# Altium schematic sheet [3]4G.SchDoc
size A4
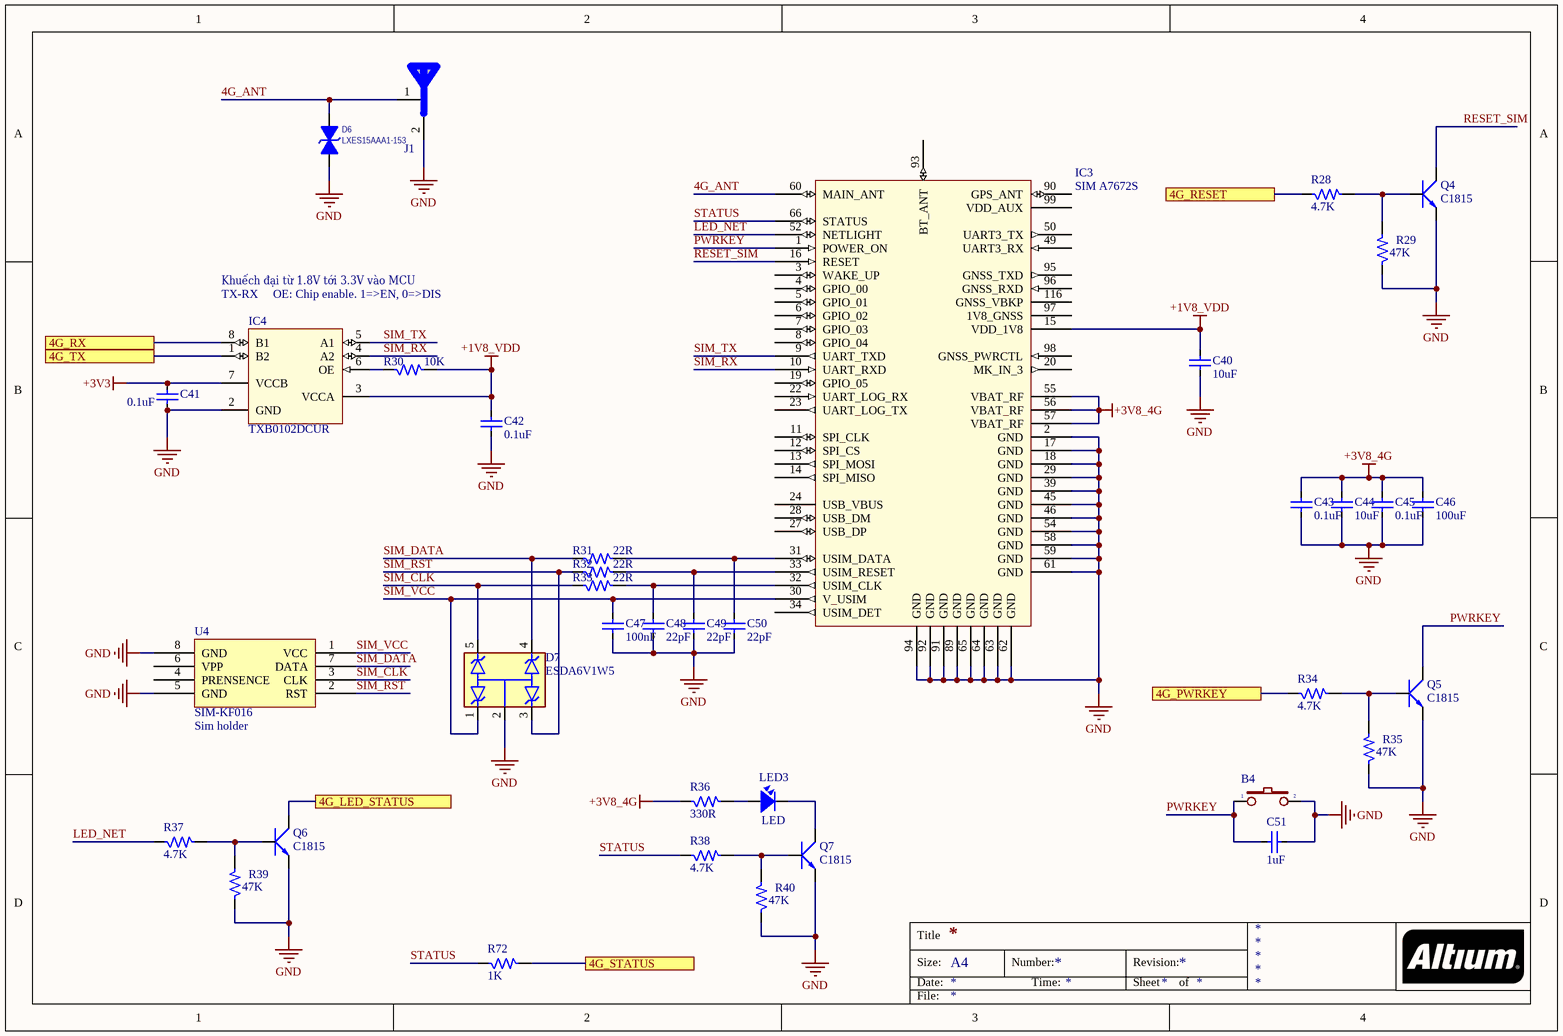
[diagram p0: [3]4G.SchDoc]

## Parts
B4  Button 3x4x2.5  [Button 3x4x2.5]  (value not drawn)
C40  10uF  [CAP_0805]
C41  0.1uF  [CAP_0805]
C42  0.1uF  [CAP_0805]
C43  0.1uF  [CAP_0805]
C44  10uF  [CAP_0805]
C45  0.1uF  [CAP_0805]
C46  100uF  [CAP_0805]
C47  100nF  [CAP_0805]
C48  22pF  [CAP_0805]
C49  22pF  [CAP_0805]
C50  22pF  [CAP_0805]
C51  1uF  [CAP_0805]
D6  LXES15AAA1-153  [R-0402]
D7  ESDA6V1W5  [SOT65P210X110-5N]
IC3  SIM A7672S  [SIM A7672S]
IC4  TXB0102DCUR  [US8]
J1  GPS  [Antenna-MCX5.08-H5]  (value not drawn)
LED3  LED  [LED-0805-Red]
Q4  C1815  [SOT23B]
Q5  C1815  [SOT23B]
Q6  C1815  [SOT23B]
Q7  C1815  [SOT23B]
R28  4.7K  [R0805]
R29  47K  [R0805]
R30  10K  [R0805]
R31  22R  [R0805]
R32  22R  [R0805]
R33  22R  [R0805]
R34  4.7K  [R0805]
R35  47K  [R0805]
R36  330R  [R0805]
R37  4.7K  [R0805]
R38  4.7K  [R0805]
R39  47K  [R0805]
R40  47K  [R0805]
R72  1K  [R0805]
U4  SIM-KF016  value Sim holder  [Sim Socket]

## Ports
4G_LED_STATUS, 4G_PWRKEY, 4G_RESET, 4G_RX, 4G_STATUS, 4G_TX

## Nets
+1V8_VDD: C40.2 C42.2 IC3.15(RESERVED) IC4.3(VCCA) R30.2
+3V3: C41.2 IC4.7(VCCB)
+3V8_4G: C43.2 C44.2 C45.2 C46.2 IC3.55(VBAT_RF) IC3.56(VBAT_RF) IC3.57(VBAT_RF) R36.1
GND: B4.2 C40.1 C41.1 C42.1 C43.1 C44.1 C45.1 C46.1 C47.1 C48.1 C49.1 C50.1 C51.1 D6.2(K) D7.2 IC3.2(GND) IC3.17(GND) IC3.18(GND) IC3.29(KEYPAD_0) IC3.39(GND) IC3.45(GND) IC3.46(ADC2) IC3.54(GPIO4) IC3.58(GND) IC3.59(GND) IC3.61(GND) IC3.62(GND) IC3.63(GND) IC3.64(GND) IC3.65(GND) IC3.89(GND) IC3.91(GND) IC3.92(GND) IC3.94(GND) IC4.2(GND) J1.2(GND) Q4.1(E) Q5.1(E) Q6.1(E) Q7.1(E) R29.1 R35.1 R39.1 R40.1 U4.5(GND) U4.8(GND)
4G_ANT: D6.1(A) IC3.60(MAIN_ANT) J1.1(GND)
4G_LED_STATUS: Q6.2(C) ; port 4G_LED_STATUS
4G_PWRKEY: R34.1 ; port 4G_PWRKEY
4G_RESET: R28.1 ; port 4G_RESET
4G_RX: IC4.8(B1) ; port 4G_RX
4G_STATUS: R72.2 ; port 4G_STATUS
4G_TX: IC4.1(B2) ; port 4G_TX
LED_NET: IC3.52(GPIO41) R37.1
PWRKEY: B4.1 C51.2 IC3.1(POWER_ON) Q5.2(C)
RESET_SIM: IC3.16(RESERVED) Q4.2(C)
SIM_CLK: D7.5 R33.1 U4.3(CLK)
SIM_DATA: D7.4 R31.1 U4.7(DATA)
SIM_RST: D7.3 R32.1 U4.2(RST)
SIM_RX: IC3.10(UART_RXD) IC4.4(A2)
SIM_TX: IC3.9(UART_TXD) IC4.5(A1)
SIM_VCC: C47.2 D7.1 IC3.30(KEYPAD_2) U4.1(VCC)
STATUS: IC3.66(STATUS) R38.1 R72.1
NetC48_2: C48.2 IC3.32(KEYSENSE_N3) R33.2
NetC49_2: C49.2 IC3.33(KEYPAD_1) R32.2
NetC50_2: C50.2 IC3.31(KEYSENSE_N2) R31.2
NetIC4_6: IC4.6(OE) R30.1
NetLED3_1: LED3.1 R36.2
NetLED3_2: LED3.2 Q7.2(C)
NetQ4_3: Q4.3(B) R28.2 R29.2
NetQ5_3: Q5.3(B) R34.2 R35.2
NetQ6_3: Q6.3(B) R37.2 R39.2
NetQ7_3: Q7.3(B) R38.2 R40.2

Not connected (* = marked no-connect by the designer): IC3 3(WAKE_UP) 4(GPIO_00) 5(GPIO_01) 6(GPIO_02) 7(GPIO_03) 8(GPIO_04) 11(SPI_CLK) 12(SPI_CS) 13(SPI_MOSI) 14(SPI_MISO) 19(GPIO_05) 20(MK_IN_3) 21(SPK_M) 22(SPK_P) 23(MIC1P) 24(MIC1N) 25(EAR1N) 26(EAR1P) 27(KEYSENSE_N1) 28(KEYSENSE_N0) 34(KEYPAD_4) 35(KEYPAD_3) 36(KEYSENSE_N4) 47(ADC1) 48(GPIO44) 49(GPIO40) 50(GPIO43) 51(GPIO1) 53(GPIO42) 73(PCM_DOUT) 74(PCM_DIN) 75(PCM_SYNC) 76(PCM_CLK) 90(GPS_ANT) 93(BT_ANT) 95(GNSS_TXD) 96(GNSS_RXD) 97(1V8_GNSS) 98(GNSS_PWRCTL) 99(VDD_AUX) 116(GNSS_VBKP); U4 4(PRENSENCE) 6(VPP)

## Notes on the sheet
- Khuếch đại từ 1.8V tới 3.3V vào MCU
- (near IC4) TX-RX     OE: Chip enable. 1=>EN, 0=>DIS
- Title
- Size:
- Date:
- A4
- Number:
- Time:
- Revision:
- Sheet
- of
- File:

## Library data of the parts
B4 = Button 3x4x2.5: pin to pad: 1>15 2>19
C40-C51 = CapSMD: Capacitor; Value: 33p; Published: 8-Jun-2000; LatestRevisionDate: 17-Jul-2002; LatestRevisionNote: Re-released for DXP Platform.; PackageReference: RAD-0.3; Publisher: Altium Limited
D6 = TVS: TVS DIODE 4VWM 1005; Manufacturer: Murata Electronics; Value: 4V; Category: Circuit Protection; Package: 0402; Part number: LXES15AAA1-153; User_Description: TVS DIODE 4VWM 1005
D7 = ESDA6V1W5: - Clamp - Ipp Tvs Diode Surface Mount SOT-323-5; MF: STMicroelectronics; SnapEDA_Link: https://www.snapeda.com/parts/ESDA6V1W5/STMicroelectronics/view-part/?ref=snap; Availability: In Stock; Price: None; Value: *; Check_prices: https://www.snapeda.com/parts/ESDA6V1W5/STMicroelectronics/view-part/?ref=eda; Purchase-URL: https://pricing.snapeda.com/search/part/ESDA6V1W5/?ref=eda; MP: ESDA6V1W5; Package: SOT-323 STMicroelectronics
IC3 = SIM A7672S: SIM A7672S-CAT-M1; Part number: SIM A7672S
IC4 = TXB0102DCUR: IC TRNSLTR BIDIRECTIONAL US8; Manufacturer: Texas Instruments; Category: IC Logic Level; Package: 8-VSSOP; Part number: TXB0102DCUR; User_Description: IC TRNSLTR BIDIRECTIONAL US8
J1 = ANTEN
LED3 = LED: LED Single colour Green and Red; Value: LED 3 ly Single Colour
Q4-Q7 = C1815: NPN 600mW, ECB; Value: C1815
R28-R40 = RM: Resistor SMD; Value: 1K
R72 = RM: Resistor SMD; Value: 1K
U4 = Sim holder: SIM Card Holder KF-016; pin to pad: 4>8 8>none